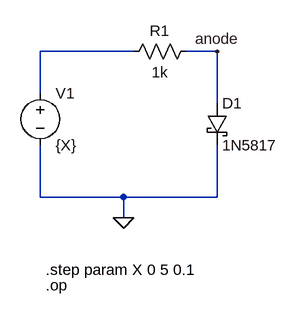
[diagram p0: schematic Operating_Point_Diode.asc]
Operating_Point_Diode.asc, the LTspice schematic file:
Version 4
SHEET 1 880 680
WIRE 224 48 80 48
WIRE 352 48 304 48
WIRE 80 112 80 48
WIRE 352 128 352 48
WIRE 80 272 80 192
WIRE 208 272 80 272
WIRE 352 272 352 192
WIRE 352 272 208 272
WIRE 208 304 208 272
FLAG 208 304 0
FLAG 352 48 anode
SYMBOL voltage 80 96 R0
SYMATTR InstName V1
SYMATTR Value {X}
SYMBOL res 320 32 R90
WINDOW 0 0 56 VBottom 2
WINDOW 3 32 56 VTop 2
SYMATTR InstName R1
SYMATTR Value 1k
SYMBOL schottky 336 128 R0
SYMATTR InstName D1
SYMATTR Value 1N5817
SYMATTR Description Diode
SYMATTR Type diode
TEXT 88 384 Left 2 !.step param X 0 5 0.1
TEXT 88 408 Left 2 !.op

The netlist it stands for:
* Operating_Point_Diode.asc
V1 N001 0 {X}
R1 anode N001 1k
D1 anode 0 1N5817
.model D D
.lib standard.dio
.step param X 0 5 0.1
.op
.backanno
.end

* Results of the author's LTspice run, read from the files saved beside the schematic
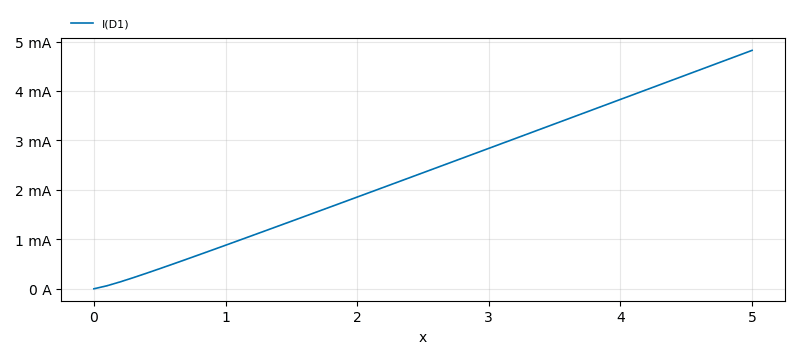
[diagram p1: Operating Point of Operating_Point_Diode.asc, plotted from the saved traces]
* Operating Point, 1 run:
*   I(D1): 0 A at x=0, 4.821 mA at x=5 , min 0 A, max 4.821 mA
* From the log:
*   Semiconductor Device Operating Points:
*                           --- Diodes ---
*   Name:      d1
*   Model:   1n5817
*   Id:      0.00e+00
*   Vd:      0.00e+00
*   Req:     1.12e+03
*   CAP:     1.90e-10